# Altium schematic sheet GATE_DRIVER.SchDoc
size A4; SheetNumber: 4; SheetTotal: 6
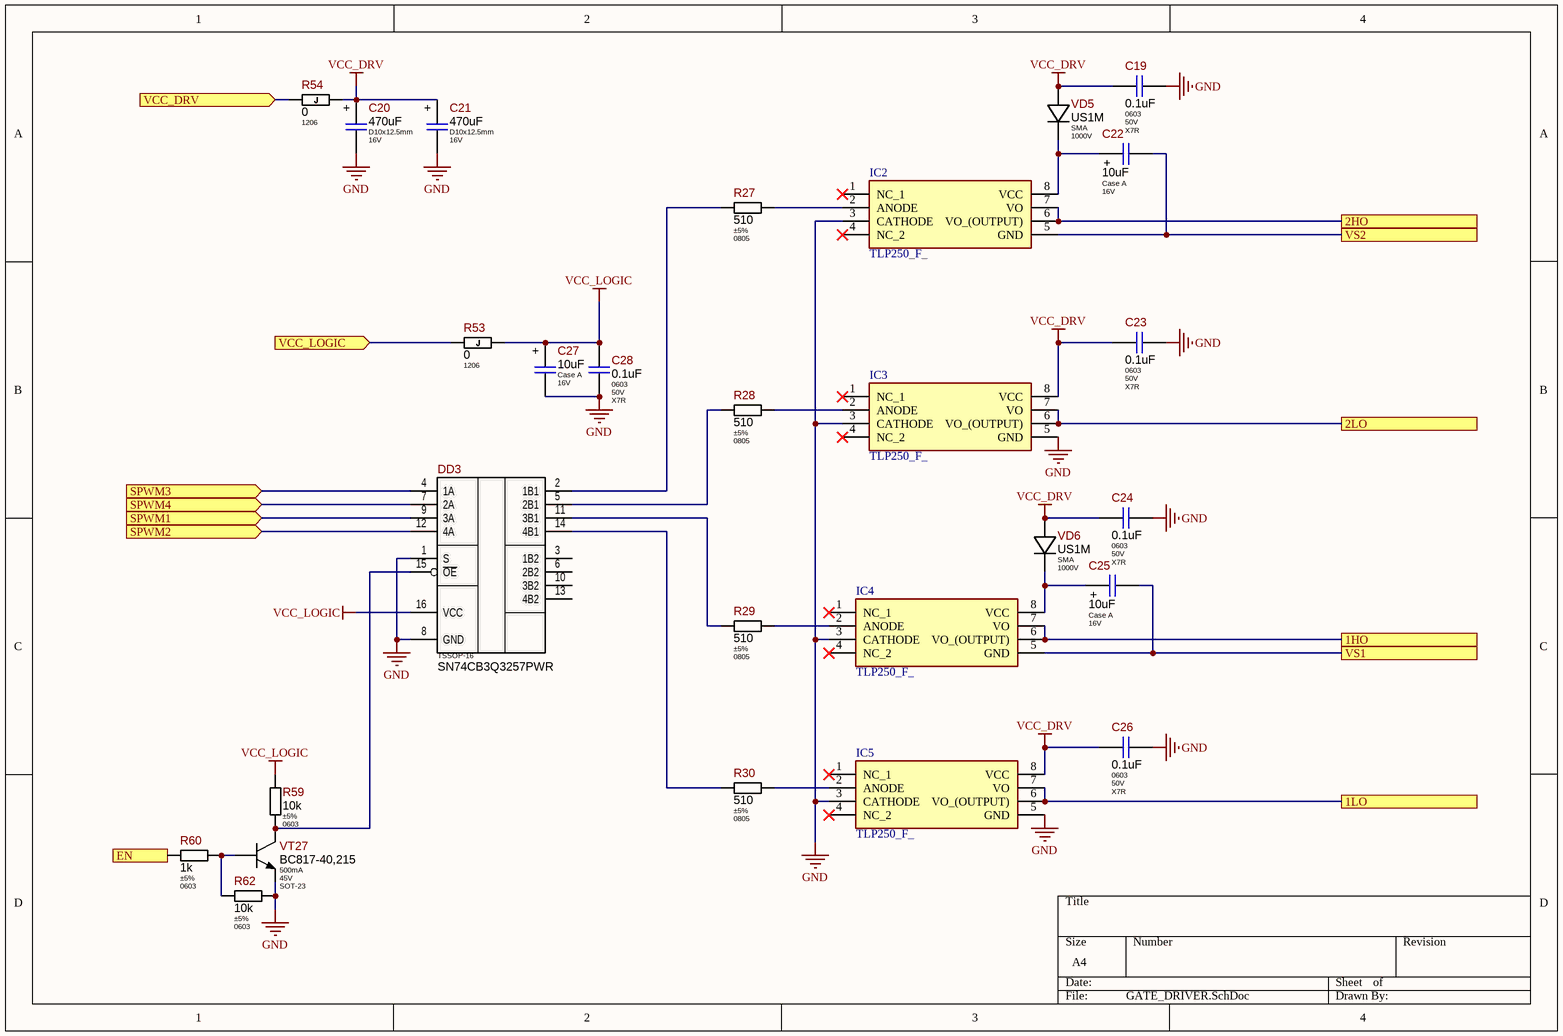
[diagram p0: GATE_DRIVER.SchDoc]

## Parts
C19  Package: 0603  Voltage: 50V  Dielectric Type: X7R  [C_CERAMIC_0603_MED]  (hidden comment: 0.1uF)
C20  value 470uF  Package: D10x12.5mm  Voltage: 16V  [CAP-AE-PTH-100D10x125H15]  (hidden comment: 470uFx16V)
C21  value 470uF  Package: D10x12.5mm  Voltage: 16V  [CAP-AE-PTH-100D10x125H15]  (hidden comment: 470uFx16V)
C22  Package: Case A  Voltage: 16V  [C_TANTAL_CASE_A_MED]  (hidden comment: 10uF)
C23  Package: 0603  Voltage: 50V  Dielectric Type: X7R  [C_CERAMIC_0603_MED]  (hidden comment: 0.1uF)
C24  Package: 0603  Voltage: 50V  Dielectric Type: X7R  [C_CERAMIC_0603_MED]  (hidden comment: 0.1uF)
C25  Package: Case A  Voltage: 16V  [C_TANTAL_CASE_A_MED]  (hidden comment: 10uF)
C26  Package: 0603  Voltage: 50V  Dielectric Type: X7R  [C_CERAMIC_0603_MED]  (hidden comment: 0.1uF)
C27  Package: Case A  Voltage: 16V  [C_TANTAL_CASE_A_MED]  (hidden comment: 10uF)
C28  Package: 0603  Voltage: 50V  Dielectric Type: X7R  [C_CERAMIC_0603_MED]  (hidden comment: 0.1uF)
DD3  SN74CB3Q3257PWR  [TSSOP-16]
IC2  TLP250_F_  [DIP762W60P254L966H485Q8N]
IC3  TLP250_F_  [DIP762W60P254L966H485Q8N]
IC4  TLP250_F_  [DIP762W60P254L966H485Q8N]
IC5  TLP250_F_  [DIP762W60P254L966H485Q8N]
R27  Tolerance: ±5%  Package: 0805  [R_ANY_CHIP_0805_MED]  (hidden comment: 510)
R28  Tolerance: ±5%  Package: 0805  [R_ANY_CHIP_0805_MED]  (hidden comment: 510)
R29  Tolerance: ±5%  Package: 0805  [R_ANY_CHIP_0805_MED]  (hidden comment: 510)
R30  Tolerance: ±5%  Package: 0805  [R_ANY_CHIP_0805_MED]  (hidden comment: 510)
R53  Package: 1206  [R_ANY_CHIP_1206_MED]  (hidden comment: 0)
R54  Package: 1206  [R_ANY_CHIP_1206_MED]  (hidden comment: 0)
R59  Tolerance: ±5%  Package: 0603  [R_ANY_CHIP_0603_MED]  (hidden comment: 10k)
R60  Tolerance: ±5%  Package: 0603  [R_ANY_CHIP_0603_MED]  (hidden comment: 1k)
R62  Tolerance: ±5%  Package: 0603  [R_ANY_CHIP_0603_MED]  (hidden comment: 10k)
VD5  Package: SMA  Voltage: 1000V  [SMA_MED]  (hidden comment: US1M)
VD6  Package: SMA  Voltage: 1000V  [SMA_MED]  (hidden comment: US1M)
VT27  Ic: 500mA  Vce: 45V  Package: SOT-23  [SOT-23_MED]  (hidden comment: BC817-40,215)

## Ports
1HO, 1LO, 2HO, 2LO, EN (in), SPWM1 (in), SPWM2 (in), SPWM3 (in), SPWM4 (in), VCC_DRV (in), VCC_LOGIC (in), VS1, VS2

## Nets
GND: C19.2 C20.2 C21.2 C23.2 C24.2 C26.2 C27.2 C28.1 DD3.1(S) DD3.8(GND) IC2.3(CATHODE) IC3.3(CATHODE) IC3.5(GND) IC4.3(CATHODE) IC5.3(CATHODE) IC5.5(GND) R62.1 VT27.2(E)
VCC_DRV: C19.1 C20.1 C21.1 C23.1 C24.1 C26.1 IC3.8(VCC) IC5.8(VCC) R54.1 VD5.AN VD6.AN
VCC_LOGIC: C27.1 C28.2 DD3.16(VCC) R53.1 R59.2
1HO: IC4.6(VO_(OUTPUT)) IC4.7(VO) ; port 1HO
1LO: IC5.6(VO_(OUTPUT)) IC5.7(VO) ; port 1LO
2HO: IC2.6(VO_(OUTPUT)) IC2.7(VO) ; port 2HO
2LO: IC3.6(VO_(OUTPUT)) IC3.7(VO) ; port 2LO
EN: R60.1 ; port EN
SPWM1: DD3.9(3A) ; port SPWM1
SPWM2: DD3.12(4A) ; port SPWM2
SPWM3: DD3.4(1A) ; port SPWM3
SPWM4: DD3.7(2A) ; port SPWM4
VCC_DRV: R54.2 ; port VCC_DRV  [a separate net that carries the same name]
VCC_LOGIC: R53.2 ; port VCC_LOGIC  [a separate net that carries the same name]
VS1: C25.2 IC4.5(GND) ; port VS1
VS2: C22.2 IC2.5(GND) ; port VS2
NetC22_1: C22.1 IC2.8(VCC) VD5.CA
NetC25_1: C25.1 IC4.8(VCC) VD6.CA
NetDD3_2: DD3.2(1B1) R27.1
NetDD3_5: DD3.5(2B1) R28.1
NetDD3_11: DD3.11(3B1) R29.1
NetDD3_14: DD3.14(4B1) R30.1
NetDD3_15: DD3.15(~{OE}) R59.1 VT27.3(C)
NetIC2_2: IC2.2(ANODE) R27.2
NetIC3_2: IC3.2(ANODE) R28.2
NetIC4_2: IC4.2(ANODE) R29.2
NetIC5_2: IC5.2(ANODE) R30.2
NetR60_2: R60.2 R62.2 VT27.1(B)

Not connected (* = marked no-connect by the designer): DD3 3(1B2) 6(2B2) 10(3B2) 13(4B2); IC2 1(NC_1)* 4(NC_2)*; IC3 1(NC_1)* 4(NC_2)*; IC4 1(NC_1)* 4(NC_2)*; IC5 1(NC_1)* 4(NC_2)*

## Notes on the sheet
- (in symbol EXR471M16B) +
- (in symbol TAJA106K016RNJ) +

## Library data of the parts
C19 C23 C24 C26 C28 = CL10B104KB8NNND: 100nF 50V X7R ±10% 0603 Ceramic Capacitor RoHS; Manufacturer: Samsung Electro-Mechanics; Ajax_1C_ID: 21313; Ajax_1C_PN: 100nF 50V X7R 10% 0603 CL10B104KB8NNND ceramic capacitor SMD; Ajax_1С_Status: Substitution; Standard Lead Time: 18 Weeks; Component Status: Released; Replacement: CL10B104KB8NNNC; GUID_1C: f1fd6399-ca68-11ea-ab63-0050569f2651; Value: 0.1uF; Part Number: CL10B104KB8NNND; Part Type: Ceramic / X7R / 0603; Component Type: SMD; Temperature Range: -55°C ~ 125°C; Tolerance: ±10%; ComponentLink1URL: https://media.digikey.com/pdf/Data%20Sheets/Samsung%20PDFs/CL_Series_MLCC_ds.pdf; Supplier 1: Digi-Key; Supplier Part Number 1: CL10B104KB8NNND-ND; Price: 0,0039378; ComponentLink1Description: Datasheet
C20 C21 = EXR471M16B: 470uF 16V D10x12.5mm Electrolytic Low Impedance; Manufacturer: Hitano; Ajax_1C_ID: 15747; Ajax_1C_PN: 470uF 16V 10x12.5mm EXR EXR471M16B-Hitano pcs; Ajax_1С_Status: Mass Production; Standard Lead Time: NONE; Component Status: Released; Tolerance: ±20%; GUID_1C: 3364ee07-6280-11e9-ab4f-0050569f2651; Part Number: EXR471M16B; Part Type: Aluminum; Component Type: PTH; Temperature Range: -40°C ~ 105°C; Dielectric Type: NONE; ComponentLink1URL: https://www.hitano.com.tw/wp-content/uploads/doc/EXR_20200408.pdf; Replacement: NONE; Price: 0,045; ComponentLink1Description: Datasheet
C22 C25 C27 = TAJA106K016RNJ: 10uF 16V ±10% Case A Tantalum Capacitors, 3Ohm; Manufacturer: AVX; Ajax_1C_ID: 6332; Ajax_1C_PN: 10uF 16V case A TAJA106K016RNJ-AVX Ceramic Capacitor SMD RoHS; Ajax_1С_Status: RND Only; Standard Lead Time: 25 Weeks; Component Status: Released; Dielectric Type: NONE; GUID_1C: b7f6d7ac-ecab-11e4-ad28-a45d36c4a9e5; Value: 10uF; Part Number: TAJA106K016RNJ; Part Type: Tantalum; Component Type: SMD; Temperature Range: -55°C ~ 125°C; Tolerance: ±10%; ComponentLink1URL: https://eu.mouser.com/datasheet/2/40/AVXC_S_A0011957049_1-2538439.pdf; Supplier 1: Mouser; Supplier Part Number 1: 581-TAJA106K016R; Replacement: NONE; Price: 0,06584713; ComponentLink1Description: Datasheet
DD3 = SN74CB3Q3257PWR: 4-Bit 1-of-2 FET Multiplexer/Demultiplexer 2.5V/3.3V Low-Voltage High-Bandwidth Bus Switch; Manufacturer: Texas Instruments; Ajax_1C_ID: 9738; Ajax_1C_PN: SN74CB3Q3257PWR микросхема; Ajax_1С_Status: RND Only; Standard Lead Time: 8 Weeks; Component Status: Released; Replacement: NONE; GUID_1C: ccf75652-0f3c-11e7-82d9-d8cb8a9acc66; Package: TSSOP-16; Part Number: SN74CB3Q3257PWR; Part Type: Logic / Multiplexer/Demultiplexer; Component Type: SMD; Temperature Range: -40°C ~ 85°C; ComponentLink1URL: http://www.ti.com/lit/ds/symlink/sn74cb3q3257.pdf; Supplier 1: Digi-Key; Supplier Part Number 1: 296-19138-1-ND; Price: 0,337; ComponentLink1Description: Datasheet
IC2-IC5 = TLP250_F_: Integrated Circuit; Manufacturer_Name: Toshiba; Manufacturer_Part_Number: TLP250(F); Datasheet Link: https://datasheet.datasheetarchive.com/originals/distributors/Datasheets-DGA20/76463.pdf; Height: 4.85mm; Mouser Part Number: 757-TLP250(F); Mouser Price/Stock: https://www.mouser.co.uk/ProductDetail/Toshiba/TLP250F?qs=f0GatGUIxV2cDxQrFeprhQ%3D%3D; Arrow Part Number: TLP250(F); Arrow Price/Stock: https://www.arrow.com/en/products/tlp250-f/toshiba
R27-R30 = CRCW0805510RJNEA: 510 Ohms ±5%, 1/8W 0805 Thick Film Resistor; Manufacturer: Vishay; Ajax_1C_ID: 9454; Ajax_1C_PN: 510R 5% 0805 Resistors SMD RoHS; Ajax_1С_Status: RND Only; Power Rating: 0.125W; Voltage: 150V; Component Status: Released; Temperature Stability: ±200ppm/°C; Replacement: NONE; GUID_1C: 51b8dd24-e3a6-11e6-82a2-d8cb8a9acc66; Value: 510; Part Number: CRCW0805510RJNEA; Component Type: SMD; Part Type: Thick Film; Temperature Range: -55°C ~ 155°C; ComponentLink1URL: https://eu.mouser.com/datasheet/2/427/dcrcwe3-1762152.pdf; Supplier 1: Mouser; Supplier Part Number 1: 71-CRCW0805510RJNEA; Price: 0,09; ComponentLink1Description: Datasheet
R53 R54 = RC1206JR-070RL: 0 Ohms Jumper, 1/4W 1206 Thick Film Resistor; Manufacturer: Yageo; Tolerance: ±5%; Ajax_1C_ID: 5515; Ajax_1C_PN: 0R 5% 1206 Resistors SMD RoHS; Ajax_1С_Status: Mass Production; Power Rating: 0.25W; Voltage: 200V; Component Status: Released; Temperature Stability: NONE; GUID_1C: 96b6e750-6b2e-11e4-9c1d-a45d36c4a9e5; Value: 0; Part Number: RC1206JR-070RL; Component Type: SMD; Part Type: Thick Film; Temperature Range: -55°C ~ 155°C; ComponentLink1URL: https://eu.mouser.com/datasheet/2/447/PYu_RC_Group_51_RoHS_L_10-1664068.pdf; Supplier 1: Digi-Key; Supplier Part Number 1: 311-0.0ERTR-ND; Replacement: NONE; Price: 0,0018; ComponentLink1Description: Datasheet
R59 R62 = RC0603JR-0710KL: 10 kOhms ±5%, 1/10W 0603 Thick Film Resistor; Manufacturer: Yageo; Ajax_1C_ID: 2860; Ajax_1C_PN: 10k 5% 0603 Resistors SMD RoHS; Ajax_1С_Status: Mass Production; Power Rating: 0.1W; Voltage: 75V; Component Status: Released; Temperature Stability: ±100ppm/°C; Replacement: NONE; GUID_1C: df4c2852-e567-11e2-9779-6c626deda1bb; Value: 10k; Part Number: RC0603JR-0710KL; Component Type: SMD; Part Type: Thick Film; Temperature Range: -55°C ~ 155°C; ComponentLink1URL: https://eu.mouser.com/datasheet/2/447/PYu_RC_Group_51_RoHS_L_10-1664068.pdf; Supplier 1: Digi-Key; Supplier Part Number 1: 311-10KGRTR-ND; Price: 0,0006; ComponentLink1Description: Datasheet
R60 = RC0603JR-071KL: 1 kOhms ±5%, 1/10W 0603 Thick Film Resistor; Manufacturer: Yageo; Ajax_1C_ID: 28124; Ajax_1C_PN: 1k 5% 0603 Resistors SMD RoHS; Ajax_1С_Status: Mass Production; Power Rating: 0.1W; Voltage: 75V; Component Status: Released; Temperature Stability: ±100ppm/°C; Replacement: NONE; GUID_1C: fbc5fd6b-8d66-11eb-ab70-0050569f2651; Value: 1k; Part Number: RC0603JR-071KL; Component Type: SMD; Part Type: Thick Film; Temperature Range: -55°C ~ 155°C; ComponentLink1URL: https://eu.mouser.com/datasheet/2/447/PYu_RC_Group_51_RoHS_L_11-1984063.pdf; Supplier 1: Digi-Key; Supplier Part Number 1: 311-1.0KGRTR-ND; Price: 0,00072; ComponentLink1Description: Datasheet
VD5 VD6 = US1M: Diode Standard 1000V 1A, 75ns, SMA; Manufacturer: Diodec Semiconductor; Ajax_1C_ID: 20461; Ajax_1C_PN: US1M-DIO 1.0A 1000V 75ns, диод; Ajax_1С_Status: Mass Production; Component Status: Released; Vf: 1.7V @ 1A; Replacement: NONE; GUID_1C: 3d137b04-96a6-11ea-ab61-0050569f2651; Part Number: US1M; Part Type: General; Component Type: SMD; Marking: US1M; Current: 1A; Temperature Range: -50°C ~ 150°C; ComponentLink1URL: https://diotec.com/request/datasheet/us1a.pdf; Supplier 1: Arrow; Supplier Part Number 1: US1M; Price: 0,02875902; ComponentLink1Description: Datasheet
VT27 = BC817-40,215: 45V, 500mA NPN General Purpose Transistor; Manufacturer: Nexperia USA; Ajax_1C_ID: 6645; Ajax_1C_PN: BC817-40,215 : NPN, sot-23 транзистор; Ajax_1С_Status: Mass Production; Component Status: Released; Standard Lead Time: 4 Weeks; Replacement: NONE; GUID_1C: 5d499e81-0f64-11e5-ad28-a45d36c4a9e5; Part Number: BC817-40,215; Part Type: NPN; Component Type: SMD; Temperature Range: -65°C ~ 150°C; ComponentLink1URL: https://eu.mouser.com/datasheet/2/916/BC817_SER-1480622.pdf; Supplier 1: Mouser; Supplier Part Number 1: 771-BC817-40-T/R; Price: 0,094; ComponentLink1Description: Datasheet